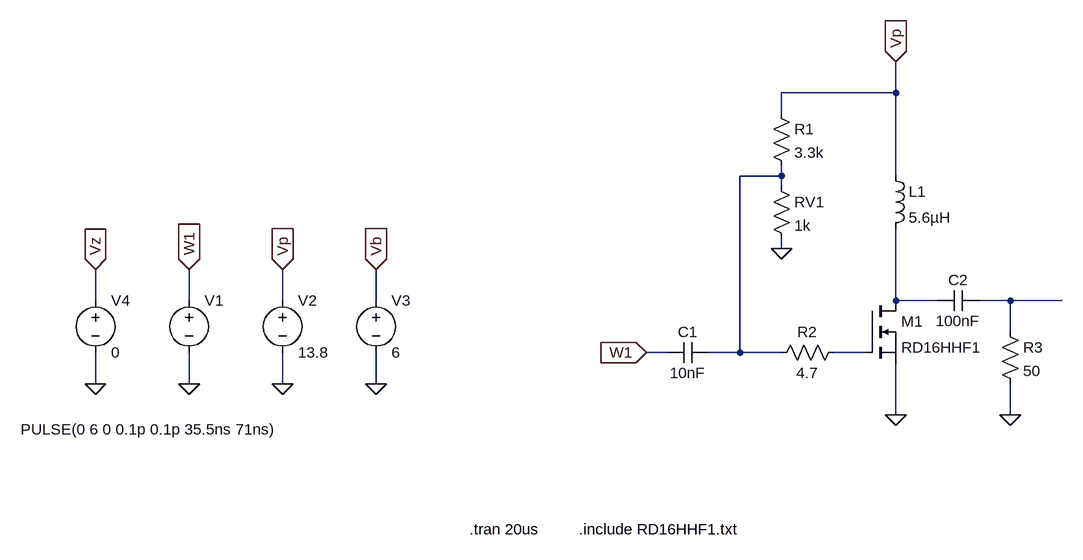
[diagram p0: schematic HF-PA-v1-Simulation-14-MHz-v8-Class-D-RD16HHF1.asc]
HF-PA-v1-Simulation-14-MHz-v8-Class-D-RD16HHF1.asc, the LTspice schematic file:
Version 4
SHEET 1 1044 680
WIRE 496 -336 496 -384
WIRE 496 -336 320 -336
WIRE 320 -304 320 -336
WIRE 320 -208 320 -224
WIRE 320 -208 256 -208
WIRE 496 -208 496 -336
WIRE 320 -192 320 -208
WIRE 320 -96 320 -112
WIRE -736 -16 -736 -64
WIRE -592 -16 -592 -64
WIRE -448 -16 -448 -64
WIRE -304 -16 -304 -64
WIRE 496 -16 496 -128
WIRE 560 -16 496 -16
WIRE 672 -16 624 -16
WIRE 752 -16 672 -16
WIRE 496 0 496 -16
WIRE 672 32 672 -16
WIRE 144 64 112 64
WIRE 256 64 256 -208
WIRE 256 64 208 64
WIRE 320 64 256 64
WIRE 448 64 400 64
WIRE -736 112 -736 64
WIRE -592 112 -592 64
WIRE -448 112 -448 64
WIRE -304 112 -304 64
WIRE 496 160 496 80
WIRE 672 160 672 112
FLAG 112 64 W1
IOPIN 112 64 In
FLAG 496 -384 Vp
IOPIN 496 -384 In
FLAG -592 112 0
FLAG -448 112 0
FLAG -592 -64 W1
IOPIN -592 -64 In
FLAG -448 -64 Vp
IOPIN -448 -64 In
FLAG 496 160 0
FLAG -304 112 0
FLAG -304 -64 Vb
IOPIN -304 -64 In
FLAG -736 -64 Vz
IOPIN -736 -64 In
FLAG -736 112 0
FLAG 672 160 0
FLAG 320 -96 0
SYMBOL voltage -592 -32 R0
WINDOW 3 -259 214 Left 2
WINDOW 123 0 0 Left 0
WINDOW 39 0 0 Left 0
SYMATTR Value PULSE(0 6 0 0.1p 0.1p 35.5ns 71ns)
SYMATTR InstName V1
SYMBOL voltage -448 -32 R0
WINDOW 123 0 0 Left 0
WINDOW 39 0 0 Left 0
SYMATTR InstName V2
SYMATTR Value 13.8
SYMBOL voltage -304 -32 R0
WINDOW 123 0 0 Left 0
WINDOW 39 0 0 Left 0
SYMATTR InstName V3
SYMATTR Value 6
SYMBOL cap 208 48 R90
WINDOW 0 0 32 VBottom 2
WINDOW 3 32 32 VTop 2
SYMATTR InstName C1
SYMATTR Value 10nF
SYMBOL ind 480 -224 R0
SYMATTR InstName L1
SYMATTR Value 5.6µH
SYMBOL voltage -736 -32 R0
WINDOW 123 0 0 Left 0
WINDOW 39 0 0 Left 0
SYMATTR InstName V4
SYMATTR Value 0
SYMBOL nmos 448 -16 R0
SYMATTR InstName M1
SYMATTR Value RD16HHF1
SYMBOL res 656 16 R0
SYMATTR InstName R3
SYMATTR Value 50
SYMBOL res 416 48 R90
WINDOW 0 0 56 VBottom 2
WINDOW 3 32 56 VTop 2
SYMATTR InstName R2
SYMATTR Value 4.7
SYMBOL res 304 -320 R0
SYMATTR InstName R1
SYMATTR Value 3.3k
SYMBOL res 304 -208 R0
SYMATTR InstName RV1
SYMATTR Value 1k
SYMBOL cap 624 -32 R90
WINDOW 0 0 32 VBottom 2
WINDOW 3 32 32 VTop 2
SYMATTR InstName C2
SYMATTR Value 100nF
TEXT -160 336 Left 2 !.tran 20us
TEXT 8 336 Left 2 !.include RD16HHF1.txt

The netlist it stands for:
* HF-PA-v1-Simulation-14-MHz-v8-Class-D-RD16HHF1.asc
V1 W1 0 PULSE(0 6 0 0.1p 0.1p 35.5ns 71ns)
V2 Vp 0 13.8
V3 Vb 0 6
C1 N001 W1 10nF
L1 Vp N002 5.6µH
V4 Vz 0 0
M1 N002 N004 0 0 RD16HHF1
R3 N003 0 50
R2 N004 N001 4.7
R1 Vp N001 3.3k
RV1 N001 0 1k
C2 N003 N002 100nF
.model NMOS NMOS
.model PMOS PMOS
.lib standard.mos
.tran 20us
.include RD16HHF1.txt
.backanno
.end